# EAGLE design ne555_v1 (EAGLE 7.7.0)
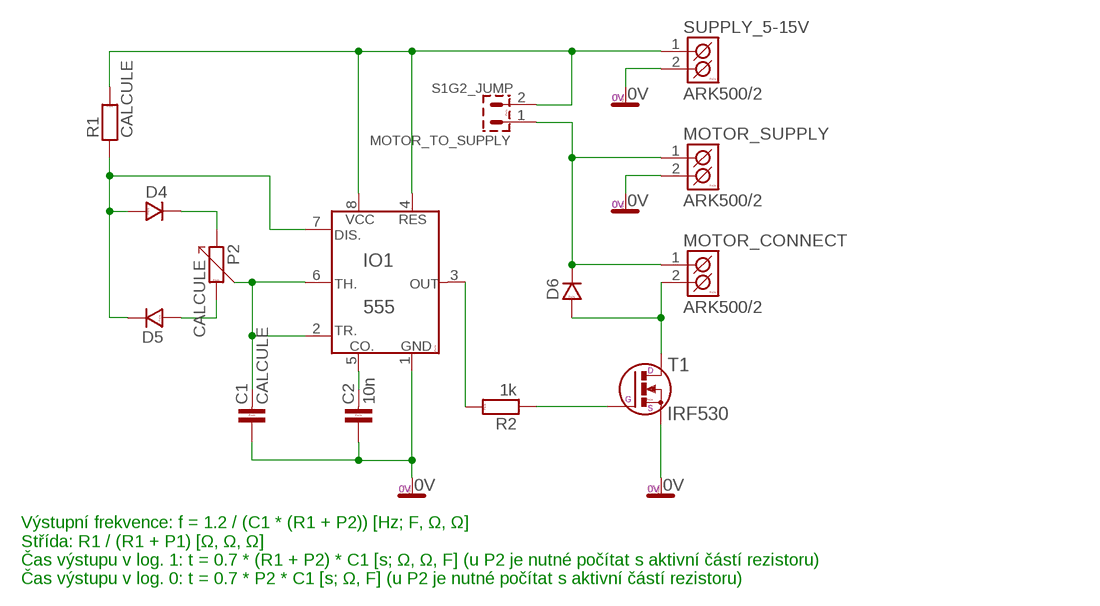
[diagram p0: schematic, sheet 1]

## Parts
C1  CALCULE  C-KER_7,5  [C-7,5]
C2  10n  C-KER_7,5  [C-7,5]
D4  D_7,5  [DO35]
D5  D_7,5  [DO35]
D6  D_7,5  [DO35]
IO1  555  [DIL8]
MOTOR_CONNECT  ARK500/2  [ARK500/2]
MOTOR_SUPPLY  ARK500/2  [ARK500/2]
MOTOR_TO_SUPPLY  S1G2_JUMP  [S1G2_JUM]
P2  CALCULE  PC16ML  [PC16ML]
R1  CALCULE  R_7,5  [R-7,5]
R2  1k  R_7,5  [R-7,5]
SUPPLY_5-15V  ARK500/2  [ARK500/2]
T1  IRF530  BUZ11  [TO-220S]

## Nets
0V: C1.1 C2.1 IO1.1(GND) MOTOR_SUPPLY.2(K2) SUPPLY_5-15V.2(K2) T1.3(S)
N$1: D5.A P2.2
N$2: D4.K P2.1
N$3: D6.K MOTOR_CONNECT.1(K1) MOTOR_SUPPLY.1(K1) MOTOR_TO_SUPPLY.1
N$5: D6.A MOTOR_CONNECT.2(K2) T1.2(D)
N$6: R2.1 T1.1(G)
N$7: IO1.3(OUT) R2.2
N$8: C2.2 IO1.5(CO.)
N$9: D4.A D5.K IO1.7(DIS.) R1.1
N$10: C1.2 IO1.2(TR.) IO1.6(TH.) P2.3
N$11: IO1.4(RES) IO1.8(VCC) MOTOR_TO_SUPPLY.2 R1.2 SUPPLY_5-15V.1(K1)

## Notes on the sheet
- Výstupní frekvence: f = 1.2 / (C1 * (R1 + P2)) [Hz; F, Ω, Ω]
  Střída: R1 / (R1 + P1) [Ω, Ω, Ω]
  Čas výstupu v log. 1: t = 0.7 * (R1 + P2) * C1 [s; Ω, Ω, F] (u P2 je nutné počítat s aktivní částí rezistoru)
  Čas výstupu v log. 0: t = 0.7 * P2 * C1 [s; Ω, F] (u P2 je nutné počítat s aktivní částí rezistoru)

## Library data of the parts
C1 C2 = #PaJa_31:C-KER: Kondenzator - keramicky
D4-D6 = #PaJa_31:D: Dioda - univerzální
IO1 = #PaJa_31:555: IO - Casovac 555
MOTOR_CONNECT MOTOR_SUPPLY SUPPLY_5-15V = #PaJa_konektory:ARK500/2: Svorkovnice - roztec 5mm - dvojita
MOTOR_TO_SUPPLY = #PaJa_konektory:S1G2_JUMP: Radove konektory - koliky - 2x
P2 = #PaJa_31:PC16ML: Potenciometr - plastovy - mono - 100R az 5M
R1 R2 = #PaJa_31:R: Rezistor
T1 = #PaJa_31:BUZ11: N-Channel Enhancement MOSFET 50V; 20A; 0,080Ohm

## Board
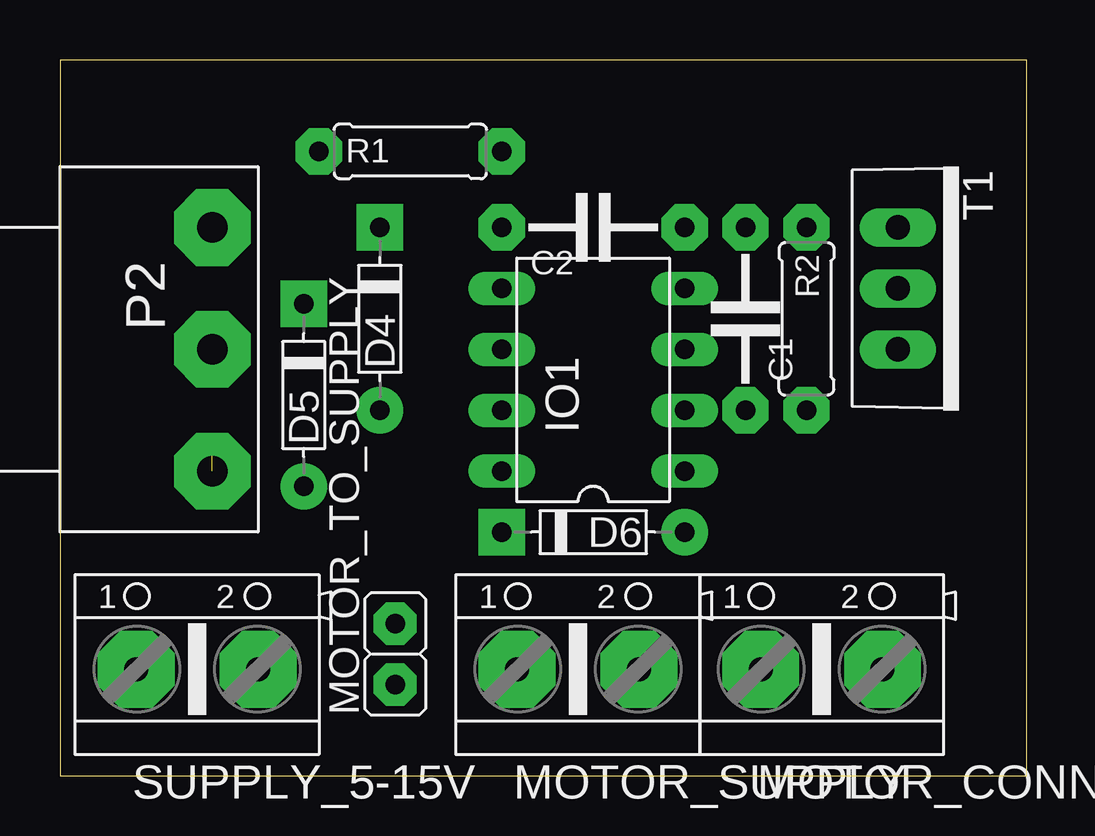
[diagram p1: board, top side]
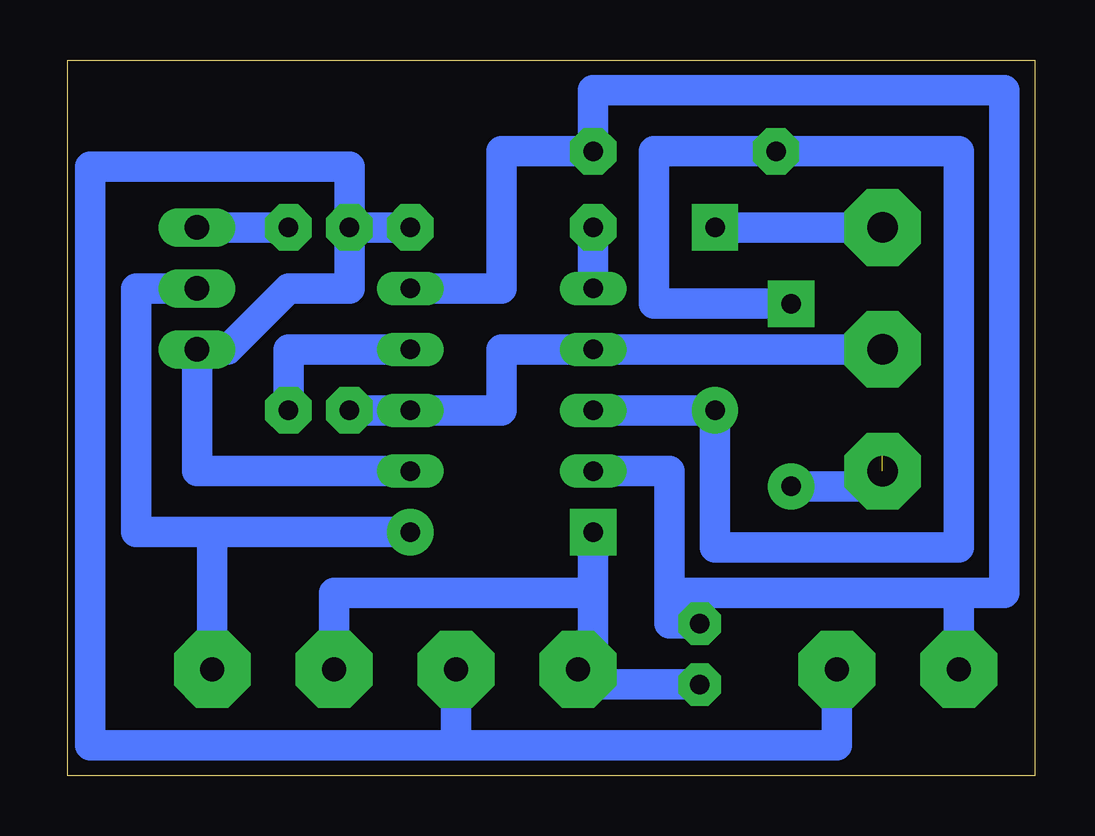
[diagram p2: board, bottom side, seen from below]

Size 40.31 x 29.84 mm. Coordinates in mm from the lower left corner, seen from the top.
Outline: 0,0 40.31,0 40.31,29.84 0,29.84 0,0
Copper layers (1*16): Top 0.035mm / dielectric 1.5mm / Bottom 0.035mm
Design rules "default": minimum track width 10mil, minimum drill 24mil, track to track 8mil, track to pad 8mil, pad to pad 8mil, via to via 8mil, smd to smd 8mil, copper to edge 40mil, drill to drill 8mil, minimum pad ring 10mil, minimum via ring 8mil, stop-mask expansion 4mil, vias tented up to drill 0mil, thermal gap 10mil

### Footprints (pad centres in the part's own frame; a part is rotated, then mirrored left to right if it is on the bottom)
C-7,5 = drill 0.813 pad 1.93 octagon: 1 -3.81,0; 2 3.81,0
DO35 = drill 0.813 pad 1.93: A -3.81,0 | drill 0.813 pad 1.93 square: K 3.81,0
DIL8 = drill 0.813 pad 1.4 long: 1 -3.81,-3.81; 2 -1.27,-3.81; 3 1.27,-3.81; 4 3.81,-3.81; 5 3.81,3.81; 6 1.27,3.81; 7 -1.27,3.81; 8 -3.81,3.81
ARK500/2 = drill 1 pad 3.2 octagon: 1 -2.54,0; 2 2.54,0
S1G2_JUM = drill 0.813 pad 1.778 octagon: 1 -1.27,0; 2 1.27,0
PC16ML = drill 1.27 pad 3.2 octagon: 1 -5.08,0; 2 5.08,0; 3 0,0
R-7,5 = drill 0.813 pad 1.93 octagon: 1 -3.81,0; 2 3.81,0
TO-220S = drill 1.016 pad 1.6 long: 1 -2.54,0; 2 0,0; 3 2.54,0

### Placement (x,y rotation side)
C1  28.57,19.05 270 top
C2  22.23,22.86 180 top
D4  13.34,19.05 90 top
D5  10.16,15.88 90 top
D6  22.23,10.16 180 top
IO1  22.23,16.51 90 top
MOTOR_CONNECT  31.75,4.45 0 top
MOTOR_SUPPLY  21.59,4.45 0 top
MOTOR_TO_SUPPLY  13.97,5.08 90 top
P2  6.35,17.78 270 top
R1  14.61,26.04 0 top
R2  31.11,19.05 270 top
SUPPLY_5-15V  5.71,4.45 0 top
T1  34.92,20.32 270 top

### Tracks (layer width: path | path; a pad name or v marks a point on that pad's centre or on a via)
0V
  Bottom 1.27: SUPPLY_5-15V.2 8.26,1.27 24.13,1.27 | C2.1 C1.1 | MOTOR_SUPPLY.2 24.13,1.27 | 24.13,1.27 39.37,1.27 39.37,25.4 28.57,25.4 C1.1 | C1.1 28.57,20.32 31.11,20.32 33.66,17.78 T1.3 34.92,12.7 IO1.1
N$1  (1 unrouted)
  Bottom 1.27: D5.A 6.35,12.06 P2.2
N$2
  Bottom 1.27: D4.K P2.1
N$3
  Bottom 1.27: 18.41,4.45 MOTOR_SUPPLY.1 | D6.K 18.41,7.62 | 18.41,7.62 18.41,4.45 | MOTOR_CONNECT.1 29.21,7.62 18.41,7.62 | MOTOR_TO_SUPPLY.1 18.41,3.81 18.41,4.45
N$5
  Bottom 1.27: 34.29,10.16 37.47,10.16 37.47,20.32 T1.2 | MOTOR_CONNECT.2 34.29,10.16 | D6.A 34.29,10.16
N$6
  Bottom 1.27: T1.1 R2.1
N$7
  Bottom 1.27: IO1.3 31.11,17.78 R2.2
N$8
  Bottom 1.27: IO1.5 C2.2
N$9
  Bottom 1.27: D5.K 15.88,19.68 15.88,26.04 R1.1 3.17,26.04 3.17,9.53 13.34,9.53 D4.A IO1.7
N$10
  Bottom 1.27: C1.2 IO1.2 22.23,15.24 22.23,17.78 IO1.6 P2.3
N$11
  Bottom 1.27: IO1.4 22.23,20.32 22.23,26.04 R1.2 18.41,28.57 1.27,28.57 1.27,7.62 3.17,7.62 | MOTOR_TO_SUPPLY.2 15.24,6.35 15.24,7.62 | 15.24,7.62 15.24,12.7 IO1.8 | 3.17,7.62 SUPPLY_5-15V.1 | 3.17,7.62 15.24,7.62